# EAGLE design mctrli2c (EAGLE 9.1.0)
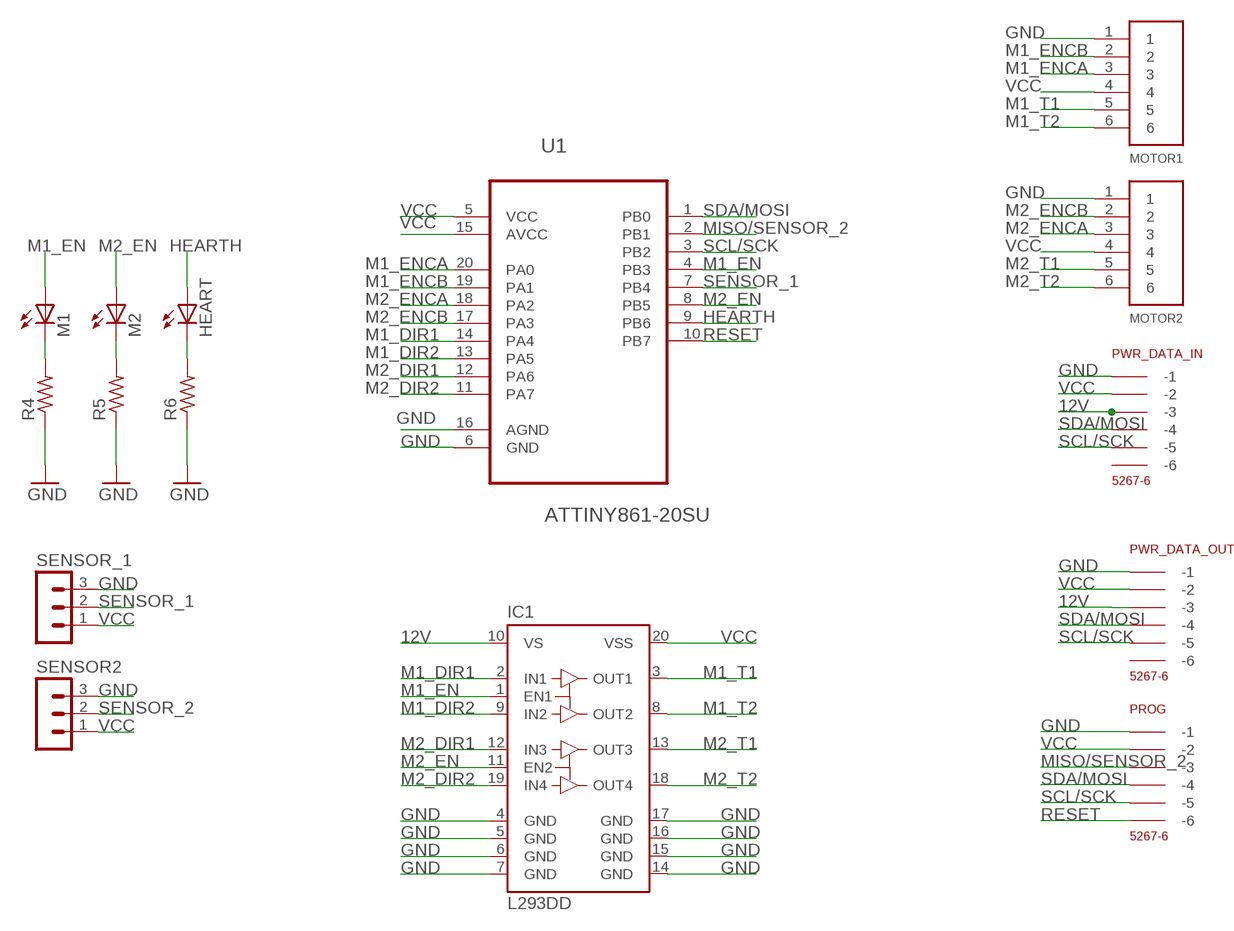
[diagram p0: schematic, sheet 1]

## Parts
HEART  LEDSML1206  [SML1206]
IC1  L293DD  [SO20]
M1  LEDSML1206  [SML1206]
M2  LEDSML1206  [SML1206]
MOTOR1  6PIN  [B6B-PH-K-S]
MOTOR2  6PIN  [B6B-PH-K-S]
PROG  5267-6  [5267-6]
PWR_DATA_IN  5267-6  [5267-6]
PWR_DATA_OUT  5267-6  [5267-6]
R4  R-US_R1210  [R1210]
R5  R-US_R1210  [R1210]
R6  R-US_R1210  [R1210]
SENSOR2  MA03-1  [MA03-1]
SENSOR_1  MA03-1  [MA03-1]
U1  ATTINY861-20SU  [SOIC127P1032X265-20N]

## Nets
12V [pwr]: IC1.10(VS) PWR_DATA_IN.P$3(-3) PWR_DATA_OUT.P$3(-3)
GND [pwr]: IC1.4(GND) IC1.5(GND) IC1.6(GND) IC1.7(GND) IC1.14(GND) IC1.15(GND) IC1.16(GND) IC1.17(GND) MOTOR1.1 MOTOR2.1 PROG.P$1(-1) PWR_DATA_IN.P$1(-1) PWR_DATA_OUT.P$1(-1) R4.1 R5.1 R6.1 SENSOR2.3 SENSOR_1.3 U1.6(GND) U1.16(AGND)
HEARTH: HEART.A U1.9(PB6)
M1_DIR1: IC1.2(IN1) U1.14(PA4)
M1_DIR2: IC1.9(IN2) U1.13(PA5)
M1_EN: IC1.1(EN1) M1.A U1.4(PB3)
M1_ENCA: MOTOR1.3 U1.20(PA0)
M1_ENCB: MOTOR1.2 U1.19(PA1)
M1_T1 [pwr]: IC1.3(OUT1) MOTOR1.5
M1_T2 [pwr]: IC1.8(OUT2) MOTOR1.6
M2_DIR1: IC1.12(IN3) U1.12(PA6)
M2_DIR2: IC1.19(IN4) U1.11(PA7)
M2_EN: IC1.11(EN2) M2.A U1.8(PB5)
M2_ENCA: MOTOR2.3 U1.18(PA2)
M2_ENCB: MOTOR2.2 U1.17(PA3)
M2_T1 [pwr]: IC1.13(OUT3) MOTOR2.5
M2_T2 [pwr]: IC1.18(OUT4) MOTOR2.6
MISO/SENSOR_2: PROG.P$3(-3) U1.2(PB1)
N$1: M1.C R4.2
N$2: M2.C R5.2
N$3: HEART.C R6.2
N$6: PWR_DATA_IN.P$6(-6)
RESET: PROG.P$6(-6) U1.10(PB7)
SCL/SCK: PROG.P$5(-5) PWR_DATA_IN.P$5(-5) PWR_DATA_OUT.P$5(-5) U1.3(PB2)
SDA/MOSI: PROG.P$4(-4) PWR_DATA_IN.P$4(-4) PWR_DATA_OUT.P$4(-4) U1.1(PB0)
SENSOR_1: SENSOR_1.2 U1.7(PB4)
SENSOR_2: SENSOR2.2
VCC: IC1.20(VSS) MOTOR1.4 MOTOR2.4 PROG.P$2(-2) PWR_DATA_IN.P$2(-2) PWR_DATA_OUT.P$2(-2) SENSOR2.1 SENSOR_1.1 U1.5(VCC) U1.15(AVCC)
Unconnected: PWR_DATA_OUT.P$6(-6)

## Library data of the parts
HEART M1 M2 = led:LED: LED OSRAM: - CHIPLED LG R971, LG N971, LY N971, LG Q971, LY Q971, LO R971, LY R971 LH N974, LH R974 LS Q976, LO Q976, LY Q976 LO Q996 - Hyper CHIPLED LW Q18S LB Q993, LB Q99A, LB R99A - SideLED LS A670, LO A670, LY A670, LG A670, LP A670 LB A673, LV A673, LT A673, LW A673 LH A674 LY A675 LS A676, LA A676, LO A676, LY A676, LW A676 LS A679, LY A679, LG A679 - Hyper Micro SIDELED® LS Y876, LA Y876, LO Y876, LY Y876 LT Y87S - SmartLED LW L88C, LW L88S LB L89C, LB L89S, LG L890 LS L89K, LO L89K, LY L89K LS L896, LA L896, LO L896, LY L896 - TOPLED LS T670, LO T670, LY T670, LG T670, LP T670 LSG T670, LSP T670, LSY T670, LOP T670, LYG T670 LG T671, LOG T671, LSG T671 LB T673, LV T673, LT T673, LW T673 LH T674 LS T676, LA T676, LO T676, LY T676, LB T676, LH T676, LSB T676, LW T676 LB T67C, LV T67C, LT T67C, LS T67K, LO T67K, LY T67K, LW E67C LS E67B, LA E67B, LO E67B, LY E67B, LB E67C, LV E67C, LT E67C LW T67C LS T679, LY T679, LG T679 LS T770, LO T770, LY T770, LG T770, LP T770 LB T773, LV T773, LT T773, LW T773 LH T774 LS E675, LA E675, LY E675, LS T675 LS T776, LA T776, LO T776, LY T776, LB T776 LHGB T686 LT T68C, LB T68C - Hyper Mini TOPLED® LB M676 - Mini TOPLED Santana® LG M470 LS M47K, LO M47K, LY M47K Source: http://www.osram.convergy.de LUXEON: - LUMILED® LXK2-PW12-R00, LXK2-PW12-S00, LXK2-PW14-U00, LXK2-PW14-V00 LXK2-PM12-R00, LXK2-PM12-S00, LXK2-PM14-U00 LXK2-PE12-Q00, LXK2-PE12-R00, LXK2-PE12-S00, LXK2-PE14-T00, LXK2-PE14-U00 LXK2-PB12-K00, LXK2-PB12-L00, LXK2-PB12-M00, LXK2-PB14-N00, LXK2-PB14-P00, LXK2-PB14-Q00 LXK2-PR12-L00, LXK2-PR12-M00, LXK2-PR14-Q00, LXK2-PR14-R00 LXK2-PD12-Q00, LXK2-PD12-R00, LXK2-PD12-S00 LXK2-PH12-R00, LXK2-PH12-S00 LXK2-PL12-P00, LXK2-PL12-Q00, LXK2-PL12-R00 Source: www.luxeon.com KINGBRIGHT: KA-3528ASYC Source: www.kingbright.com
IC1 = st-microelectronics:L293DD: PUSH-PULL FOUR CHANNEL DRIVER WITH DIODES Source: http://www.st.com/stonline/books/pdf/docs/1330.pdf; OC_FARNELL: unknown
MOTOR1 MOTOR2 = jst_eph:6PIN
PROG PWR_DATA_IN PWR_DATA_OUT = con-molex-spox:5267-6
R4-R6 = resistor:R-US_: RESISTOR, American symbol
SENSOR2 SENSOR_1 = con-lstb:MA03-1: PIN HEADER; OC_FARNELL: unknown; OC_NEWARK: unknown
U1 = Atmel_By_element14_Batch_1-00:ATTINY861-20SU: 8-bit Microcontroller with In-System Programmable Flash; MPN: ATTINY861-20SU; OC_FARNELL: 1455168; OC_NEWARK: 58M3801; PACKAGE: SOIC-20; SUPPLIER: Atmel

## Net classes
0 default: width 0.3 mm, clearance 0.05 mm
1 pwr: width 0.7 mm, clearance 0.1 mm

## Board
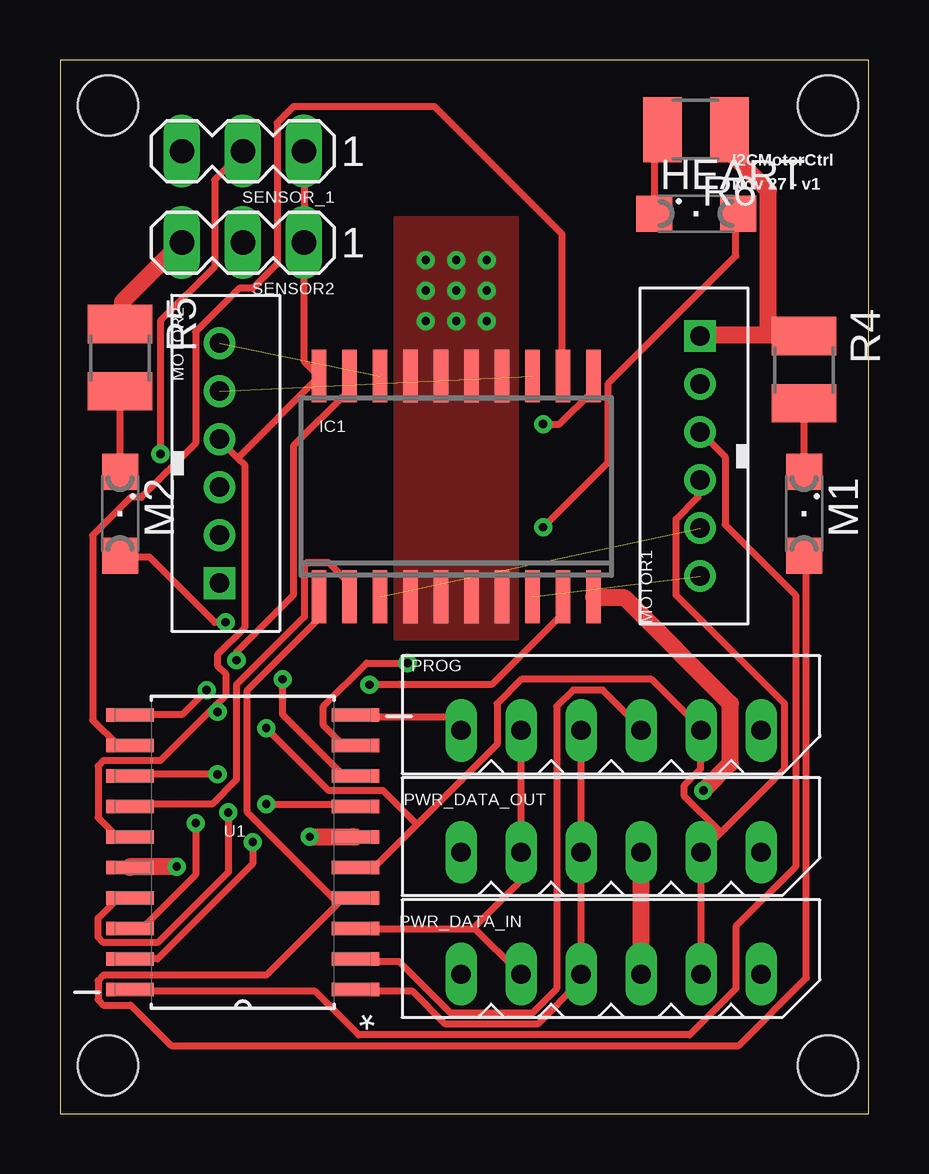
[diagram p1: board, top side]
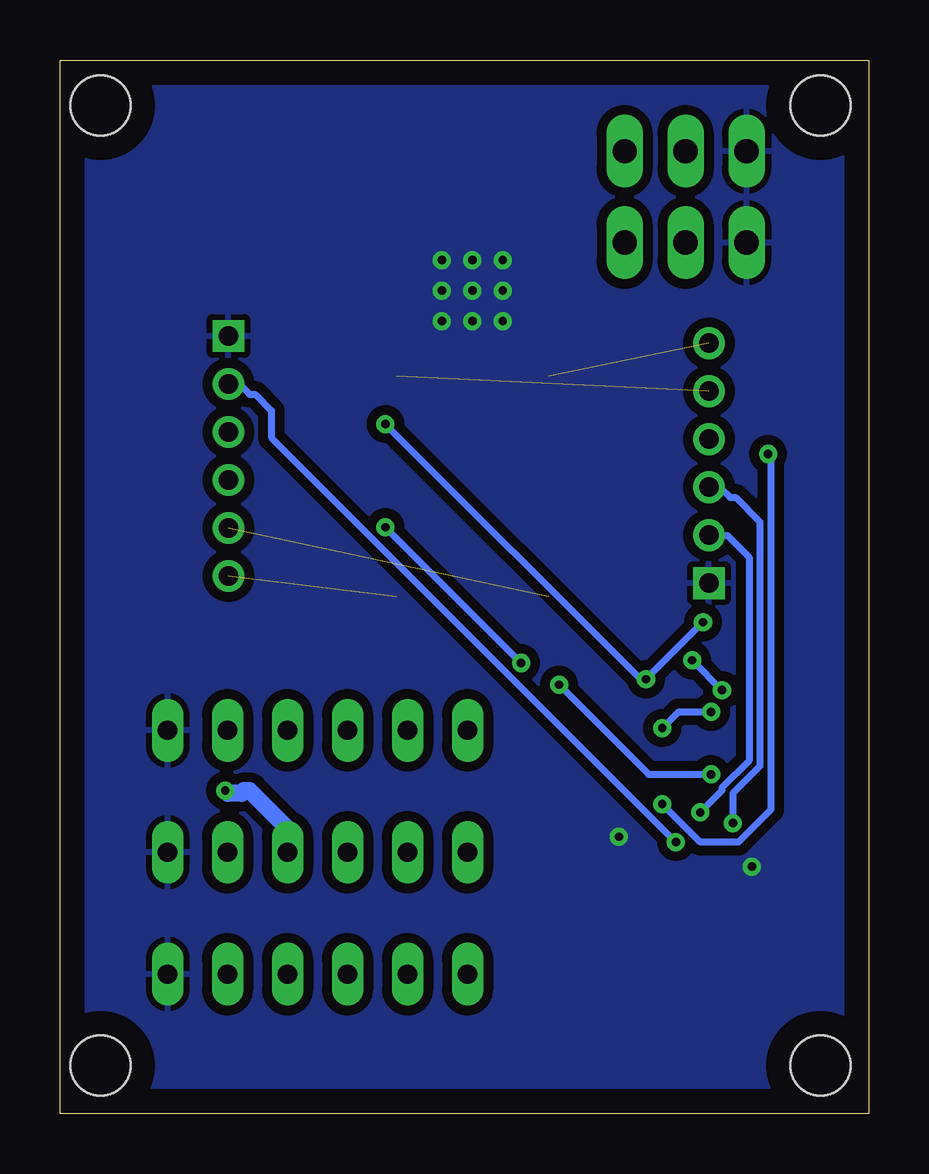
[diagram p2: board, bottom side, seen from below]

Size 33.69 x 43.9 mm. Coordinates in mm from the lower left corner, seen from the top.
Outline: 0,0 33.69,0 33.69,43.9 0,43.9 0,0
Copper layers (1*16): Top 0.035mm / dielectric 1.5mm / Bottom 0.035mm
Design rules "default *": minimum track width 6mil, minimum drill 0.35mm, track to track 6mil, track to pad 6mil, pad to pad 6mil, via to via 6mil, smd to smd 6mil, copper to edge 40mil, drill to drill 6mil, minimum pad ring 10mil, minimum via ring 8mil, stop-mask expansion 4mil, vias tented up to drill 0mil, thermal gap 10mil
Holes 2.5 mm at 2,42 2,2 32,42 32,2

### Footprints (pad centres in the part's own frame; a part is rotated, then mirrored left to right if it is on the bottom)
SML1206 = smd 1.5 x 1.5: A 1.75,0; C -1.75,0
SO20 = smd 0.6 x 2.2: 1 -5.715,-4.6; 2 -4.445,-4.6; 3 -3.175,-4.6; 4 -1.905,-4.6; 5 -0.635,-4.6; 6 0.635,-4.6; 7 1.905,-4.6; 8 3.175,-4.6; 9 4.445,-4.6; 10 5.715,-4.6; 11 5.715,4.6; 12 4.445,4.6; 13 3.175,4.6; 14 1.905,4.6; 15 0.635,4.6; 16 -0.635,4.6; 17 -1.905,4.6; 18 -3.175,4.6; 19 -4.445,4.6; 20 -5.715,4.6
B6B-PH-K-S = drill 0.813 square: 1 5,0 | drill 0.813: 2 3,0; 3 1,0; 4 -1,0; 5 -3,0; 6 -5,0
5267-6 = drill 0.8 long: P$1 0,0; P$2 2.5,0; P$3 5,0; P$4 7.5,0; P$5 10,0; P$6 12.5,0
R1210 = smd 1.6 x 2.7: 1 -1.4,0; 2 1.4,0
MA03-1 = drill 1.016 long: 1 -2.54,0; 2 0,0; 3 2.54,0
SOIC127P1032X265-20N = smd 1.981 x 0.559: 1 -4.699,5.715; 2 -4.699,4.445; 3 -4.699,3.175; 4 -4.699,1.905; 5 -4.699,0.635; 6 -4.699,-0.635; 7 -4.699,-1.905; 8 -4.699,-3.175; 9 -4.699,-4.445; 10 -4.699,-5.715; 11 4.699,-5.715; 12 4.699,-4.445; 13 4.699,-3.175; 14 4.699,-1.905; 15 4.699,-0.635; 16 4.699,0.635; 17 4.699,1.905; 18 4.699,3.175; 19 4.699,4.445; 20 4.699,5.715

### Placement (x,y rotation side)
HEART  26.5,37.5 0 top
IC1  16.51,26.13 0 top
M1  31,25 270 top
M2  2.5,25 270 top
MOTOR1  26.67,27.4 90 top
MOTOR2  6.65,27.1 270 top
PROG  29.21,15.97 180 top
PWR_DATA_IN  29.21,5.81 180 top
PWR_DATA_OUT  29.21,10.89 180 top
R4  31,31 270 top
R5  2.5,31.5 270 top
R6  26.5,41 180 top
SENSOR2  7.62,36.29 180 top
SENSOR_1  7.62,40.1 180 top
U1  7.62,10.89 180 top

### Tracks (layer width: path | path; a pad name or v marks a point on that pad's centre or on a via)
12V  (via drill 0.35)
  Top 0.7: v26.8,13.46 27.94,14.59 27.94,17.08 23.52,21.49 22.28,21.49 IC1.10 | PWR_DATA_IN.P$3 24.2,5.88 24.2,10.86 PWR_DATA_OUT.P$3
  Bottom 0.7: v26.8,13.46 26.69,13.35 26.13,13.35 26.01,13.46 25.79,13.46 24.2,11.88 24.2,10.97 PWR_DATA_OUT.P$3
GND  (via drill 0.35)
  Top 0.7: v4.86,10.29 2.94,10.29 U1.16 | v10.4,11.54 12.21,11.54 U1.6 | R5.1 2.6,32.91 2.6,33.82 4.98,36.19 SENSOR2.3 | 29.52,32.46 26.69,32.46 MOTOR1.1 | 29.52,32.46 30.99,32.46 R4.1 | R6.1 27.94,40.94 27.94,40.04 29.52,38.45 29.52,32.8 29.52,32.46
  other vias: 17.78,33.02 16.51,33.02 15.24,33.02 15.24,34.29 16.51,34.29 17.78,34.29 17.78,35.56 16.51,35.56 15.24,35.56
  pour Bottom (isolate 0.406): -6.5,44.41 -6.5,-1.5 41.91,-1.5 41.91,44.41
  pour Top (no thermals): 13.97,37.33 13.97,19.78 19.05,19.78 19.05,37.33
HEARTH  (via drill 0.35)
  Top 0.3: v20.13,24.43 22.85,27.14 22.85,30.42 28.16,35.74 28.16,37.44 HEART.A | v14.48,18.77 12.78,18.77 10.97,16.96 10.97,16.17 11.76,15.38 12.21,15.38 U1.9
  Bottom 0.3: v14.48,18.77 v20.13,24.43
M1_DIR1
  Top 0.3: U1.14 2.94,12.89 6.33,12.89 7.35,13.91 7.35,17.87 10.18,20.7 10.18,22.85 10.29,22.96 11.2,22.96 11.99,22.17 11.99,21.6 IC1.2
M1_DIR2  (via drill 0.35)
  Top 0.3: v6.56,14.14 2.94,14.14 U1.13 | v12.89,17.87 17.98,17.87 20.92,20.81 20.92,21.49 IC1.9
  Bottom 0.3: v6.56,14.14 9.16,14.14 v12.89,17.87
M1_EN
  Top 0.3: M1.A 31.1,23.19 31.1,5.66 28.27,2.83 4.64,2.83 2.94,4.52 1.81,4.52 1.58,4.75 1.58,5.54 1.81,5.77 8.6,5.77 11.76,8.94 12.21,8.94 U1.4 11.54,8.82 7.8,12.55 7.8,17.64 10.74,20.58 10.74,21.49 IC1.1
M1_ENCA
  Top 0.3: U1.20 2.94,5.09 10.63,5.09 12.44,3.28 26.24,3.28 28.16,5.2 28.16,7.8 30.65,10.29 30.65,21.6 27.71,24.54 27.71,27.37 26.69,28.39 MOTOR1.3
M1_ENCB  (via drill 0.35)
  Top 0.3: v8.03,11.31 8.03,10.4 4.07,6.45 2.94,6.45 U1.19
  Bottom 0.3: v8.03,11.31 24.88,28.16 24.88,29.29 25.56,29.97 25.79,29.97 26.13,30.31 26.58,30.31 MOTOR1.2
M1_T1  (1 unrouted)
M1_T2  (1 unrouted)
M2_DIR1
  Top 0.3: U1.12 2.83,15.38 2.38,15.38 1.36,16.4 1.36,24.09 2.94,25.67 3.39,25.67 5.66,27.94 5.66,32.57 7.46,34.38 8.03,34.38 9.05,35.4 9.05,41.28 9.73,41.96 15.61,41.96 20.92,36.64 20.92,30.76 IC1.12
M2_DIR2  (via drill 0.35)
  Top 0.3: v6.11,17.64 5.09,16.63 2.94,16.63 U1.11 | v7.35,18.89 7.35,19.23 9.73,21.6 9.73,27.82 11.99,30.09 11.99,30.65 IC1.19
  Bottom 0.3: v7.35,18.89 v6.11,17.64
M2_EN  (via drill 0.35)
  Top 0.3: v6.9,20.47 6.45,20.47 3.73,23.19 2.6,23.19 M2.A | v9.27,18.1 9.27,16.63 11.76,14.14 12.21,14.14 U1.8 | v20.13,28.73 20.81,28.73 22.17,30.09 22.17,30.65 IC1.11
  Bottom 0.3: v6.9,20.47 v9.27,18.1 9.39,18.1 9.5,18.1 v20.13,28.73
M2_ENCA  (via drill 0.35)
  Top 0.3: v5.66,12.1 5.66,9.95 3.51,7.8 2.94,7.8 U1.18
  Bottom 0.3: v5.66,12.1 5.66,13.35 4.52,14.48 4.52,24.66 5.54,25.67 5.77,25.67 6.11,26.01 6.56,26.01 MOTOR2.3
M2_ENCB  (via drill 0.35)
  Top 0.3: v7.01,12.55 7.01,10.07 4.07,7.12 1.81,7.12 1.58,7.35 1.58,8.14 2.38,8.94 2.83,8.94 U1.17
  Bottom 0.3: v7.01,12.55 6.11,13.46 6.11,13.57 4.98,14.7 4.98,23.19 5.88,24.09 6.56,24.09 MOTOR2.2
M2_T1  (1 unrouted)
M2_T2  (1 unrouted)
MISO/SENSOR_2
  Top 0.3: U1.2 12.33,6.33 14.14,6.33 16.29,4.18 19.68,4.18 20.7,5.2 20.7,16.96 21.38,17.64 22.62,17.64 24.2,16.06 PROG.P$3
N$1
  Top 0.3: M1.C 30.99,26.8 30.99,29.52 R4.2
N$2
  Top 0.3: M2.C 2.49,26.8 2.49,30.09 R5.2
N$3
  Top 0.3: HEART.C 24.77,37.55 24.77,40.72 25,40.94 R6.2
RESET
  Top 0.3: U1.10 12.33,16.51 16.17,16.51 16.63,16.06 PROG.P$6
SCL/SCK
  Top 0.3: 17.3,7.69 12.33,7.69 U1.3 | 17.3,7.69 19.11,5.88 PWR_DATA_IN.P$5 | 17.3,7.69 17.3,7.8 19.11,9.61 19.11,10.86 PWR_DATA_OUT.P$5 19.23,10.97 19.23,15.95 PROG.P$5
SDA/MOSI
  Top 0.3: U1.1 12.33,5.09 14.7,5.09 16.06,3.73 19.91,3.73 21.6,5.43 21.6,5.77 PWR_DATA_IN.P$4 21.71,5.88 21.71,10.86 PWR_DATA_OUT.P$4 21.71,10.97 21.71,15.95 PROG.P$4
SENSOR_1  (via drill 0.35)
  Top 0.3: v8.6,12.89 12.21,12.89 U1.7 | v4.18,27.48 4.18,33.02 6.45,35.29 6.45,38.91 7.58,40.04 SENSOR_1.2
  Bottom 0.3: v8.6,12.89 7.01,11.31 5.43,11.31 4.07,12.67 4.07,27.37 v4.18,27.48
VCC  (via drill 0.35)
  Top 0.3: SENSOR_1.1 10.18,40.04 10.18,36.3 SENSOR2.1 10.18,36.19 10.18,31.33 10.74,30.76 IC1.20 10.74,30.65 7.46,27.37 7.41,27.31 | 6.39,16.91 6.9,17.42 6.9,18.32 6.56,18.66 6.56,19.11 7.69,20.25 7.69,27.03 7.41,27.31 | 6.39,16.91 4.18,14.7 1.81,14.7 1.58,14.48 1.58,12.33 2.38,11.54 2.83,11.54 U1.15 | 7.41,27.31 6.67,28.05 MOTOR2.4 | 14.87,12.04 18.21,15.38 18.21,17.08 19.23,18.1 24.66,18.1 26.69,16.06 PROG.P$2 26.69,15.83 26.69,14.36 26.01,13.69 26.01,13.23 27.48,11.76 27.54,11.71 | 14.87,12.04 13.12,10.29 12.33,10.29 U1.5 | PWR_DATA_IN.P$2 26.69,5.88 26.69,10.86 PWR_DATA_OUT.P$2 26.8,10.97 27.54,11.71 | 27.54,11.71 30.2,14.36 30.2,17.08 25.67,21.6 25.67,24.77 26.58,25.67 26.58,26.35 MOTOR1.4 | v6.56,16.74 6.45,16.85 6.39,16.91 | v8.6,16.06 11.2,13.46 13.46,13.46 14.82,12.1 14.87,12.04
  Bottom 0.3: v6.56,16.74 7.92,16.74 v8.6,16.06

### Text on the board
tNames: I2CMotorCtrl | Nov 27 - v1